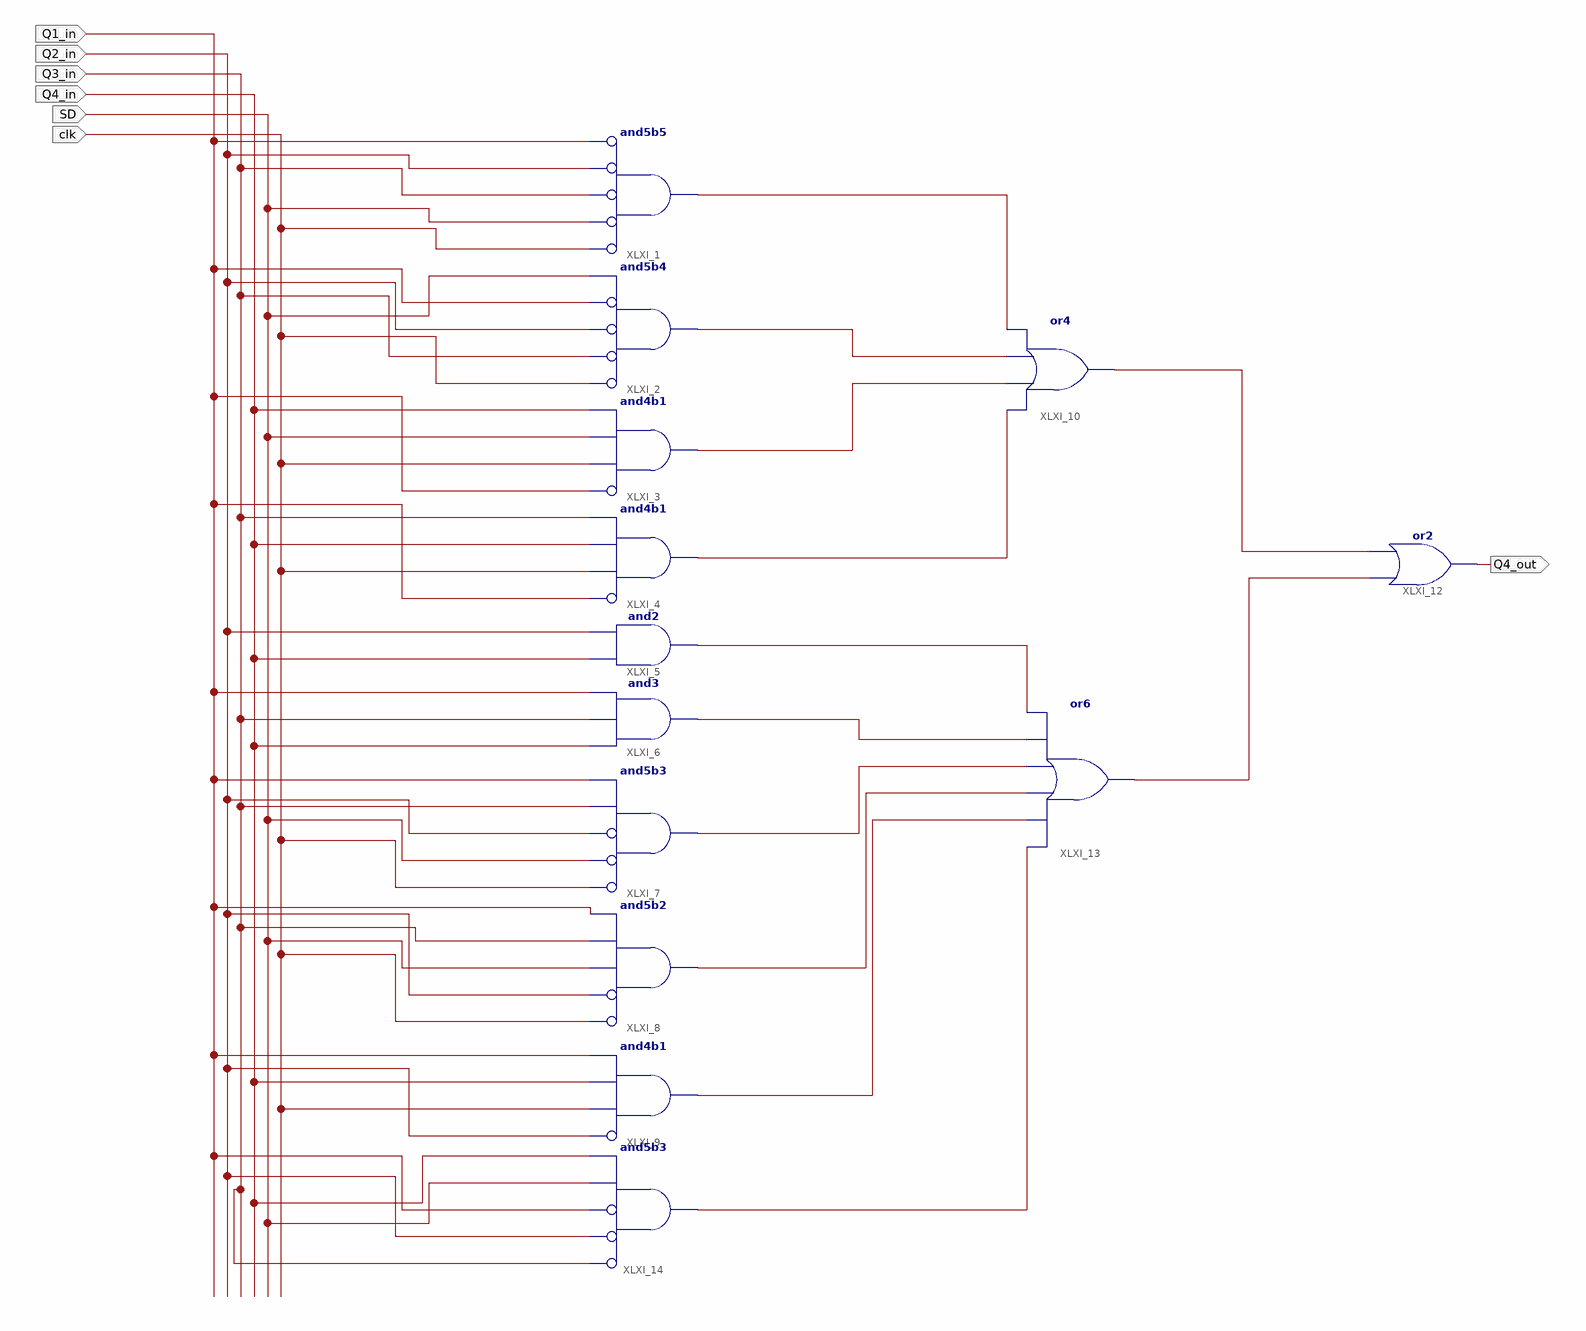
[diagram p0: schematic sheet 1]
// Xilinx ISE schematic Q4_schematic.sch (spartan6) as structural Verilog: 13 symbols, 7 ports
module Q4_schematic (
  input  Q1_in,
  input  Q2_in,
  input  Q3_in,
  input  SD,
  input  clk,
  input  Q4_in,
  output Q4_out
);

  wire XLXN_9, XLXN_10, XLXN_11, XLXN_12, XLXN_18, XLXN_19, XLXN_20, XLXN_21, XLXN_22, XLXN_23, XLXN_24,
       XLXN_26;

  and XLXI_1 (XLXN_9, ~clk, ~SD, ~Q3_in, ~Q2_in, ~Q1_in);  // and5b5
  and XLXI_2 (XLXN_10, ~clk, ~Q3_in, ~Q2_in, ~Q1_in, SD);  // and5b4
  and XLXI_3 (XLXN_11, ~Q1_in, clk, SD, Q4_in);  // and4b1
  and XLXI_4 (XLXN_12, ~Q1_in, clk, Q4_in, Q3_in);  // and4b1
  and XLXI_5 (XLXN_20, Q4_in, Q2_in);
  and XLXI_6 (XLXN_21, Q4_in, Q3_in, Q1_in);
  and XLXI_7 (XLXN_22, ~clk, ~SD, ~Q2_in, Q3_in, Q1_in);  // and5b3
  and XLXI_8 (XLXN_23, ~clk, ~Q2_in, SD, Q3_in, Q1_in);  // and5b2
  and XLXI_9 (XLXN_24, ~Q2_in, clk, Q4_in, Q1_in);  // and4b1
  or XLXI_10 (XLXN_18, XLXN_12, XLXN_11, XLXN_10, XLXN_9);
  or XLXI_12 (Q4_out, XLXN_19, XLXN_18);
  or XLXI_13 (XLXN_19, XLXN_26, XLXN_24, XLXN_23, XLXN_22, XLXN_21, XLXN_20);
  and XLXI_14 (XLXN_26, ~Q3_in, ~Q2_in, ~Q1_in, SD, Q4_in);  // and5b3
endmodule
